# Altium project nRF2788_Wireless MIC TX_V_1_0.PrjPCB
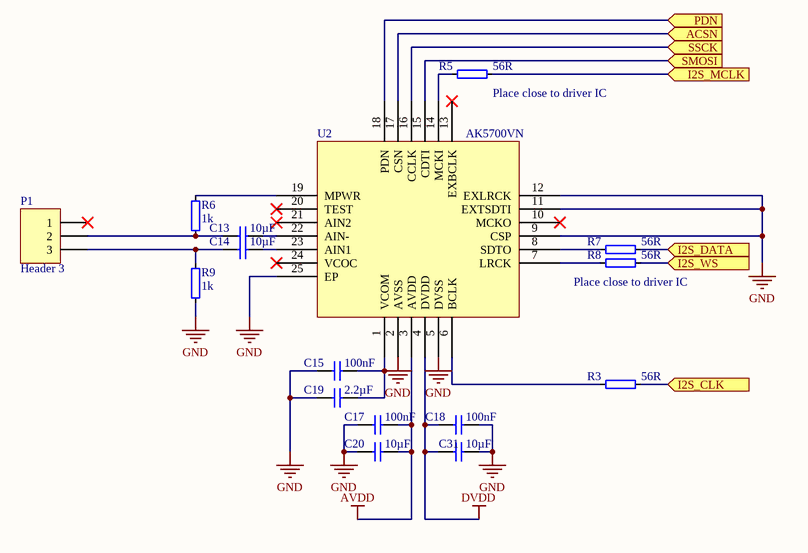
[diagram p0: ADC.SchDoc]
3 sheets, 64 parts. Net scope: flat (ports and power ports of the same name join across sheets).
Board file: nRF2788_Wireless Mic TX_rev 1_0.PcbDoc
Sheets:
  ADC.SchDoc
  MCU.SchDoc
  nRF2460.SchDoc

## Sheet ADC.SchDoc: Dual Wireless Mic TX
size A4; DrawnBy: ANOL; Revision: 1.0; SheetNumber: 2; SheetTotal: 3

### Parts
C13  10µF  [0805]
C14  10µF  [0805]
C15  100nF  [0402s]
C17  100nF  [0402s]
C18  100nF  [0402s]
C19  2.2µF  [0603s]
C20  10µF  [0603s]
C31  10µF  [0603s]
P1  Header 3  [Headphone]
R3  56R  [0402s]
R5  56R  [0402s]
R6  1k  [0402s]
R7  56R  [0402s]
R8  56R  [0402s]
R9  1k  [0402s]
U2  AK5700VN  [QFN50P400X400X80-24N]

### Ports
ACSN (in), I2S_CLK (in), I2S_DATA (in), I2S_MCLK (in), I2S_WS (in), PDN (in), SMOSI (in), SSCK (in)

### Nets
AVDD: C17.2 C20.2 U2.3(AVDD)
DVDD: C18.1 C31.1 U2.4(DVDD)
GND: C15.1 C17.1 C18.2 C19.1 C20.1 C31.2 R9.1 U2.2(AVSS) U2.5(DVSS) U2.9(CSP) U2.11(EXTSDTI) U2.12(EXLRCK) U2.25(EP)
NetC13_1: C13.1 P1.2 R6.1
NetC13_2: C13.2 U2.22(AIN-)
NetC14_1: C14.1 P1.3 R9.2
NetC14_2: C14.2 U2.23(AIN1)
NetC15_2: C15.2 C19.2 U2.1(VCOM)
NetP2_5: U2.18(PDN) ; port PDN
NetR3_1: R3.1 U2.6(BCLK)
NetR3_2: R3.2 ; port I2S_CLK
NetR5_1: R5.1 U2.14(MCKI)
NetR5_2: R5.2 ; port I2S_MCLK
NetR6_2: R6.2 U2.19(MPWR)
NetR7_1: R7.1 U2.8(SDTO)
NetR7_2: R7.2 ; port I2S_DATA
NetR8_1: R8.1 U2.7(LRCK)
NetR8_2: R8.2 ; port I2S_WS
NetU1_3: U2.16(CCLK) ; port SSCK
NetU1_6: U2.15(CDTI) ; port SMOSI
NetU2_17: U2.17(CSN) ; port ACSN

Not connected (* = marked no-connect by the designer): P1 1*; U2 10(MCKO)* 13(EXBCLK)* 20(TEST)* 21(AIN2)* 24(VCOC)*

### Notes on the sheet
- (near R5) Place close to driver IC
- (near R8) Place close to driver IC

### Library data of the parts
C13 C14 = C0805-10µ: Chip Cap 0805; Note: Chip Cap 10%; Artikkelnr Noca: 20039243; Part Number: C0805-10µ; Manufacturer: *; Manufacturer Part Number: *; Datasheet: *; LatestRevisionDate: 2010-06-03; Pin Count: 2; Publisher: Nordic Semiconductor; Published: 2010-06-03; Value: 10µF; Supplier: *; Supplier part number: *; 2nd source Supplier: *; 2nd source part number: *
C15 C17 C18 = C0402-100n: Chip Cap 0402; Note: Chip Cap 10%; Artikkelnr Noca: 20039200; Part Number: C0402-100n; Manufacturer: *; Manufacturer Part Number: *; Datasheet: *; LatestRevisionDate: 2009-11-23; Pin Count: 2; Publisher: Nordic Semiconductor; Published: 2009-05-08; Value: 100nF; Supplier: *; Supplier part number: *; 2nd source Supplier: *; 2nd source part number: *
C19 = C0603-2µ2: Chip Cap 0603; Note: Chip Cap 1%; Artikkelnr Noca: N.A.; Part Number: C0603-2µ2; Manufacturer: *; Manufacturer Part Number: *; Datasheet: *; LatestRevisionDate: 2009-05-08; Pin Count: 2; Publisher: Nordic Semiconductor; Published: 2009-05-08; Value: 2.2µF; Supplier: *; Supplier part number: *; 2nd source Supplier: *; 2nd source part number: *
C20 C31 = C0603-10µ: Chip Cap 0603; Note: Chip Cap 10%; Artikkelnr Noca: 20039252; Part Number: C0603-10µ; Manufacturer: *; Manufacturer Part Number: *; Datasheet: *; LatestRevisionDate: 2011-01-17; Pin Count: 2; Publisher: Nordic Semiconductor; Published: 2011-01-17; Value: 10µF; Supplier: *; Supplier part number: *; 2nd source Supplier: *; 2nd source part number: *
P1 = Header 3: Header, 3-Pin; LatestRevisionDate: 17-Jul-2002; LatestRevisionNote: Re-released for DXP Platform.; Publisher: Altium Limited
R3 R5 R7 R8 = R0402-56R: Chip Res 0402; Note: Chip Res 1%; Artikkelnr Noca: 27049043; Part Number: R0402-56R; Manufacturer: *; Manufacturer Part Number: *; Datasheet: *; Footprint: 0402; LatestRevisionDate: 2009-11-23; Pin Count: 2; Publisher: Nordic Semiconductor; Published: 2009-05-08; Value: 56R; Supplier: *; Supplier part number: *; 2nd source Supplier: *; 2nd source part number: *
R6 R9 = R0402-1k0: Chip Res 0402; Note: Chip Res 1%; Artikkelnr Noca: 27049073; Part Number: R0402-1k0; Manufacturer: *; Manufacturer Part Number: *; Datasheet: *; Footprint: 0402; LatestRevisionDate: 2009-11-23; Pin Count: 2; Publisher: Nordic Semiconductor; Published: 2009-05-08; Value: 1k; Supplier: *; Supplier part number: *; 2nd source Supplier: *; 2nd source part number: *

## Sheet MCU.SchDoc: Dual Wireless Mic TX
size A4; Date: 2011-06-27; DrawnBy: ANOL; Revision: 1.0; SheetNumber: 3; SheetTotal: 3
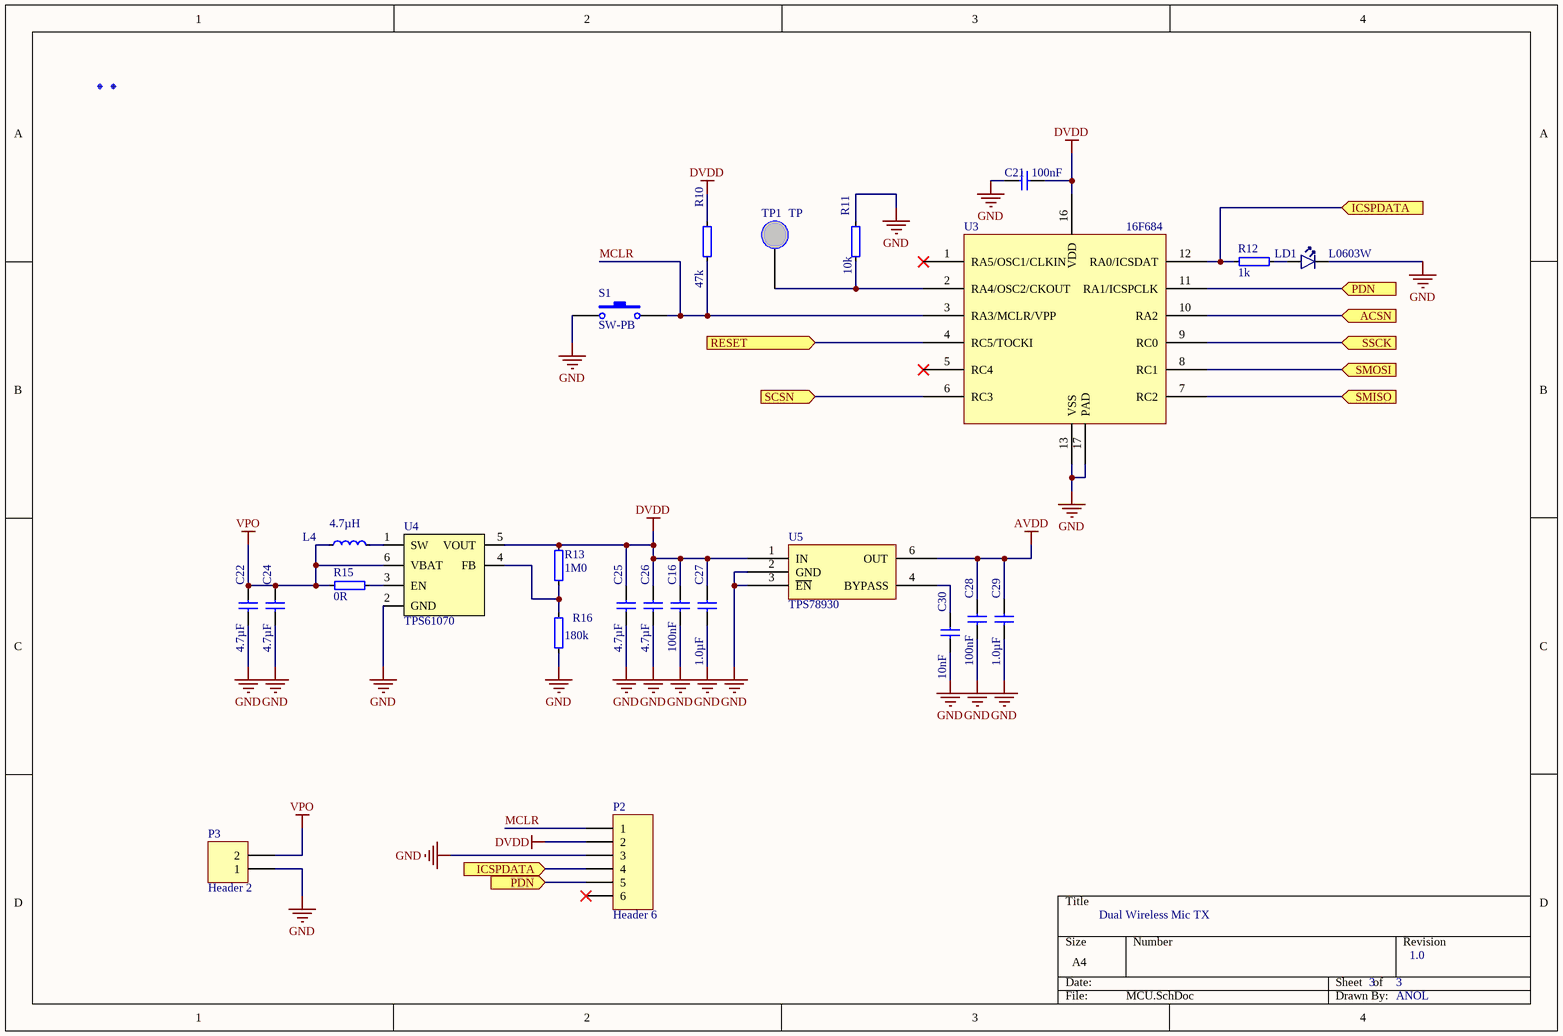
[diagram p1: MCU.SchDoc]

### Parts
C16  100nF  [0402s]
C21  100nF  [0402s]
C22  4.7µF  [0603s]
C24  4.7µF  [0603s]
C25  4.7µF  [0603s]
C26  4.7µF  [0603s]
C27  1.0µF  [0603s]
C28  100nF  [0402s]
C29  1.0µF  [0603s]
C30  10nF  [0402s]
Fid1  Fiducial mark  [Fiducial]  (value not drawn)
Fid2  Fiducial mark  [Fiducial]  (value not drawn)
L4  4.7µH  [WE-TPC_TYPE_S]
LD1  L0603W  [LED_0603]
P2  Header 6  [HDR1X6]
P3  Header 2  [HDR1X2]
R10  47k  [0402s]
R11  10k  [0402s]
R12  1k  [0402s]
R13  1M0  [0402s]
R15  0R  [0402s]
R16  180k  [0402s]
S1  SW-PB  [E-Switch]
TP1  TP  [TP]
U3  16F684  [QFN65P400X400X100-16N]
U4  TPS61070  [SOT95P280X110-6N]
U5  TPS78930  [SOT95P280X145-6N]

### Ports
ACSN (in), ICSPDATA (in), PDN (in), RESET (in), SCSN (in), SMISO (in), SMOSI (in), SSCK (in)

### Nets
AVDD: C28.2 C29.2 U5.6(OUT)
DVDD: C16.2 C21.2 C25.2 C26.2 C27.2 P2.2 R10.2 R13.2 U3.16(VDD) U4.5(VOUT) U5.1(IN)
GND: C16.1 C21.1 C22.1 C24.1 C25.1 C26.1 C27.1 C28.1 C29.1 C30.1 LD1.1(C) P2.3 P3.1 R11.2 R16.1 S1.1 U3.13(VSS) U3.17(PAD) U4.2(GND) U5.2(GND) U5.3(~{EN})
VPO: C22.2 C24.2 L4.1 P3.2 R15.1 U4.6(VBAT)
MCLR: P2.1 R10.1 S1.2 U3.3(RA3/MCLR/VPP)
NetC30_2: C30.2 U5.4(BYPASS)
NetL4_2: L4.2 U4.1(SW)
NetLD1_2: LD1.2(A) R12.2
NetP2_4: P2.4 R12.1 U3.12(RA0/ICSDAT) ; port ICSPDATA
NetP2_5: P2.5 U3.11(RA1/ICSPCLK) ; port PDN
NetR2_1: U3.4(RC5/TOCKI) ; port RESET
NetR11_1: R11.1 TP1.1 U3.2(RA4/OSC2/CKOUT)
NetR13_1: R13.1 R16.2 U4.4(FB)
NetR15_2: R15.2 U4.3(EN)
NetU1_2: U3.7(RC2) ; port SMISO
NetU1_3: U3.9(RC0) ; port SSCK
NetU1_4: U3.6(RC3) ; port SCSN
NetU1_6: U3.8(RC1) ; port SMOSI
NetU2_17: U3.10(RA2) ; port ACSN

Not connected (* = marked no-connect by the designer): P2 6*; U3 1(RA5/OSC1/CLKIN)* 5(RC4)* 14(NC) 15(NC)

### Library data of the parts
C16 C21 C28 = C0402-100n: as C15 on sheet ADC; Part Number: C0402-100n; Manufacturer: *; Manufacturer Part Number: *; Datasheet: *; LatestRevisionDate: 2009-11-23; Pin Count: 2; Publisher: Nordic Semiconductor; Published: 2009-05-08; Value: 100nF; Supplier: *; Supplier part number: *; 2nd source Supplier: *; 2nd source part number: *
C22 C24-C26 = C0603-4µ7: Chip Cap 0603; Note: Chip Cap 10%; Artikkelnr Noca: 20069060; Part Number: C0603-4µ7; Manufacturer: *; Manufacturer Part Number: *; Datasheet: *; LatestRevisionDate: 2009-11-23; Pin Count: 2; Publisher: Nordic Semiconductor; Published: 2009-05-08; Value: 4.7µF; Supplier: *; Supplier part number: *; 2nd source Supplier: *; 2nd source part number: *
C27 C29 = C0603-1µ0: Chip Cap 0603; Note: Chip Cap 10%; Artikkelnr Noca: 20039205; Part Number: C0603-1µ0; Manufacturer: *; Manufacturer Part Number: *; Datasheet: *; LatestRevisionDate: 2009-11-23; Pin Count: 2; Publisher: Nordic Semiconductor; Published: 2009-05-08; Value: 1.0µF; Supplier: *; Supplier part number: *; 2nd source Supplier: *; 2nd source part number: *
C30 = C0402-10n: Chip Cap 0402; Note: Chip Cap 10%; Artikkelnr Noca: 20039166; Part Number: C0402-10n; Manufacturer: *; Manufacturer Part Number: *; Datasheet: *; LatestRevisionDate: 2009-11-23; Pin Count: 2; Publisher: Nordic Semiconductor; Published: 2009-05-08; Value: 10nF; Supplier: *; Supplier part number: *; 2nd source Supplier: *; 2nd source part number: *
Fid1 Fid2 = Fid-Mark: Artikkelnr Noca: N.A.; Part Number: Fid-Mark; Manufacturer: *; Manufacturer Part Number: *; Datasheet: *; LatestRevisionDate: 12.12.2009; Pin Count: 1; Publisher: Nordic Semiconductor; Published: 12.12.2009; Value: *; Note: *; Supplier: *; Supplier part number: *; 2nd source Supplier: *; 2nd source part number: *
L4 = WE-TPC Type S - 4µ7: Inductor Power 4.7uH 1.2A SMD; Manufacturer: Wurth Elektronik; Manufacturer Part Number: 744031004; 2nd source part number: 732-1008-1-ND; Part Number: WE-TPC Type S - 4µ7; Datasheet: http://www.we-online.de/katalog/media/pdf/744031004.pdf; LatestRevisionDate: 2010-02-01; Pin Count: 2; Publisher: Nordic Semiconductor; Published: 2010-02-01; Value: 4.7µH; Note: *; Supplier: Farnell; Supplier part number: 163-5834; 2nd source Supplier: Digi-Key; Artikkelnr Noca: *
LD1 = 19-213/W1D: LED 0603, 19-213/W1D; Manufacturer: Everlight; Note: 45 mcd; Artikkelnr Noca: N.A.; Part Number: 19-213/W1D; Manufacturer Part Number: *; Datasheet: *; Footprint: 0603; LatestRevisionDate: 2009-05-18; Pin Count: 2; Publisher: Nordic Semiconductor; Published: 2009-05-18; Value: L0603W; Supplier: *; Supplier part number: *; 2nd source Supplier: *; 2nd source part number: *
P2 = Header 6: Header, 6-Pin; LatestRevisionDate: 17-Jul-2002; LatestRevisionNote: Re-released for DXP Platform.; Publisher: Altium Limited
P3 = Header 2: Header, 2-Pin; LatestRevisionDate: 17-Jul-2002; LatestRevisionNote: Re-released for DXP Platform.; Publisher: Altium Limited
R10 = R0402-47k: Chip Res 0402; Note: Chip Res 1%; Artikkelnr Noca: 27049113; Part Number: R0402-47k; Manufacturer: *; Manufacturer Part Number: *; Datasheet: *; Footprint: 0402; LatestRevisionDate: 2009-11-23; Pin Count: 2; Publisher: Nordic Semiconductor; Published: 2009-05-08; Value: 47k; Supplier: *; Supplier part number: *; 2nd source Supplier: *; 2nd source part number: *
R11 = R0402-10k: Chip Res 0402; Note: Chip Res 1%; Artikkelnr Noca: 27049097; Part Number: R0402-10k; Manufacturer: *; Manufacturer Part Number: *; Datasheet: *; Footprint: 0402; LatestRevisionDate: 2009-11-23; Pin Count: 2; Publisher: Nordic Semiconductor; Published: 2009-05-08; Value: 10k; Supplier: *; Supplier part number: *; 2nd source Supplier: *; 2nd source part number: *
R12 = R0402-1k0: as R6 on sheet ADC; Part Number: R0402-1k0; Manufacturer: *; Manufacturer Part Number: *; Datasheet: *; Footprint: 0402; LatestRevisionDate: 2009-11-23; Pin Count: 2; Publisher: Nordic Semiconductor; Published: 2009-05-08; Value: 1k; Supplier: *; Supplier part number: *; 2nd source Supplier: *; 2nd source part number: *
R13 = R0402-1M0: Chip Res 0402; Note: Chip Res 1%; Artikkelnr Noca: 27049145; Part Number: R0402-1M0; Manufacturer: *; Manufacturer Part Number: *; Datasheet: *; Footprint: 0402; LatestRevisionDate: 2009-11-23; Pin Count: 2; Publisher: Nordic Semiconductor; Published: 2009-05-08; Value: 1M0; Supplier: *; Supplier part number: *; 2nd source Supplier: *; 2nd source part number: *
R15 = R0402-0R: Chip Res 0402; Note: Chip Res 1%; Artikkelnr Noca: 27049000; Part Number: R0402-0R; Manufacturer: *; Manufacturer Part Number: *; Datasheet: *; Footprint: 0402; LatestRevisionDate: 2009-11-23; Pin Count: 2; Publisher: Nordic Semiconductor; Published: 2009-05-08; Value: 0R; Supplier: *; Supplier part number: *; 2nd source Supplier: *; 2nd source part number: *
R16 = R0402-180k: Chip Res 0402; Note: Chip Res 1%; Artikkelnr Noca: 27049127; Part Number: R0402-180k; Manufacturer: *; Manufacturer Part Number: *; Datasheet: *; Footprint: 0402; LatestRevisionDate: 2009-11-23; Pin Count: 2; Publisher: Nordic Semiconductor; Published: 2009-05-08; Value: 180k; Supplier: *; Supplier part number: *; 2nd source Supplier: *; 2nd source part number: *
S1 = SW-PB: Switch; Published: 24-Mar-1999; LatestRevisionDate: 17-Jul-2002; LatestRevisionNote: Re-released for DXP Platform.; PackageReference: SPST-2; Publisher: Altium Limited; PackageDescription: Switch; 2 Leads
U4 = TPS61070: IC BOOST CONV 600MA SW TSOT23-6; Manufacturer: Texas Instruments; Manufacturer Part Number: TPS61070DDCR; 2nd source part number: 296-17151-1-ND; Note: Adjustable, 600-mA Switch, 90% Efficient PFM/PWM Boost Converter in ThinSOT-23; Artikkelnr Noca: N.A.; Part Number: TPS61070; Datasheet: http://focus.ti.com/lit/ds/symlink/tps61070.pdf; Footprint: SOT-23-6; LatestRevisionDate: 2010-02-02; Pin Count: 6; Publisher: Nordic Semiconductor; Published: 2010-02-02; Value: TPS61070; Supplier: Farnell; Supplier part number: 1461062; 2nd source Supplier: Digi-Key

## Sheet nRF2460.SchDoc: Dual Wireless Mic TX
size A4; DrawnBy: ANOL; Revision: 1.0; SheetTotal: 3; : Dual Wireless Mic TX
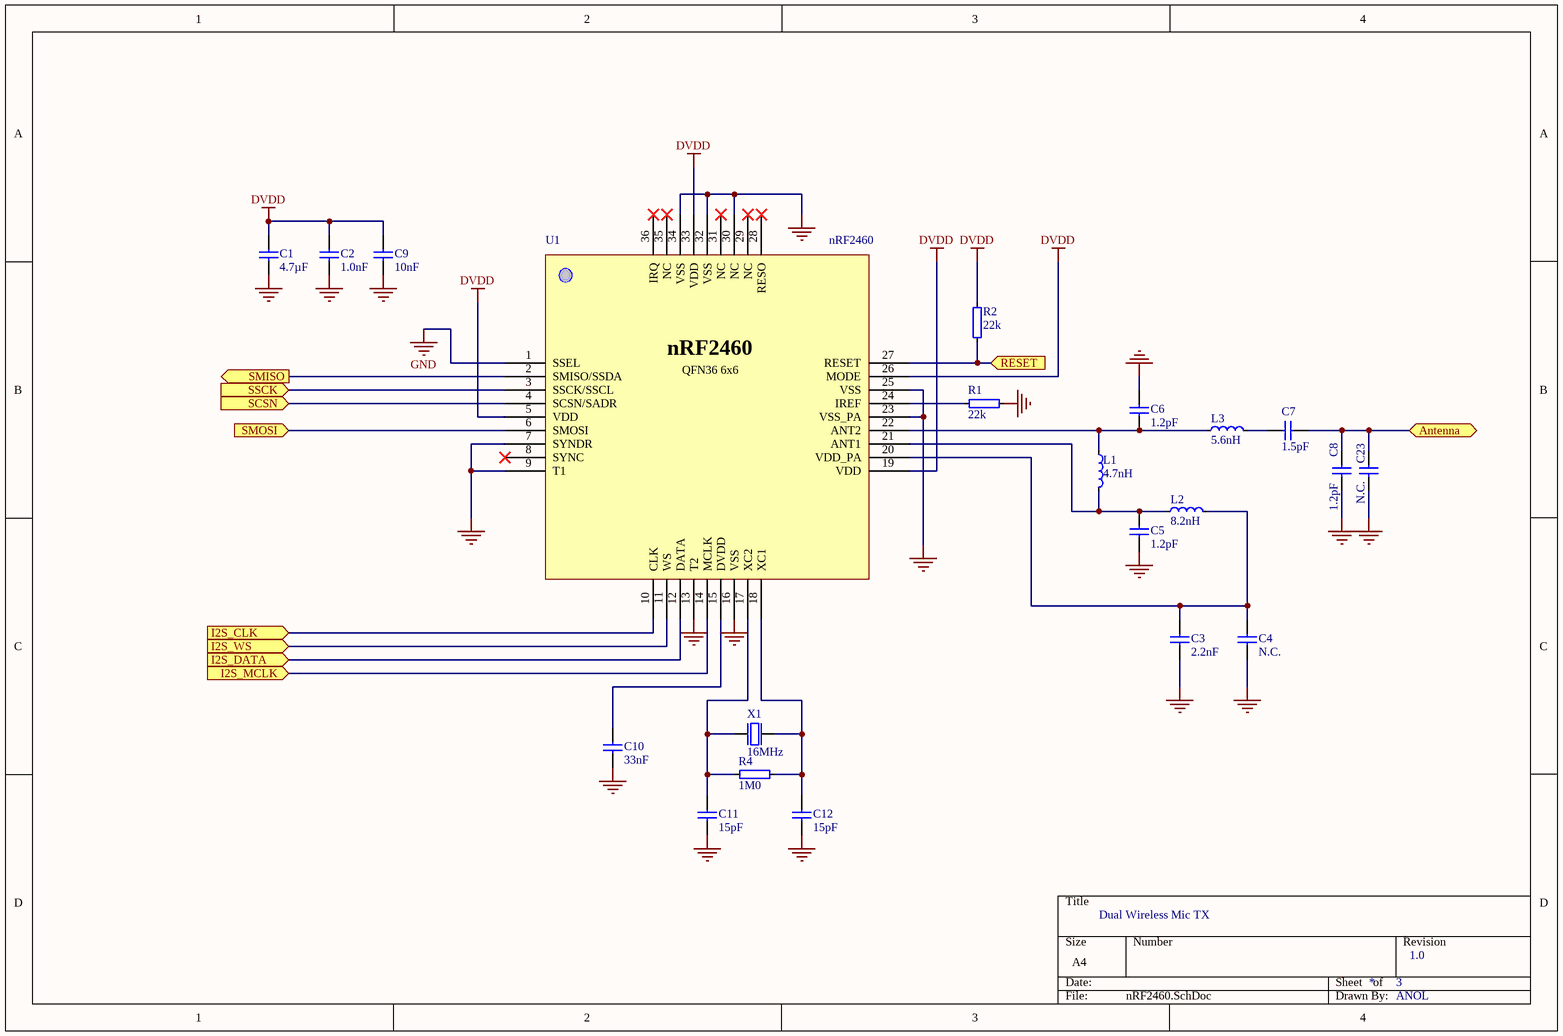
[diagram p2: nRF2460.SchDoc]

### Parts
C1  4.7µF  [0805]
C2  1.0nF  [0402s]
C3  2.2nF  [0402s]
C4  N.C.  [0402s]  (no BOM)
C5  1.2pF  [0402s]
C6  1.2pF  [0402s]
C7  1.5pF  [0402s]
C8  1.2pF  [0402s]
C9  10nF  [0402s]
C10  33nF  [0402s]
C11  15pF  [0402s]
C12  15pF  [0402s]
C23  N.C.  [0402s]  (no BOM)
L1  4.7nH  [0402s]
L2  8.2nH  [0402s]
L3  5.6nH  [0402s]
R1  22k  [0402s]
R2  22k  [0402s]
R4  1M0  [0402s]
U1  nRF2460  [Nordic_QFN36]
X1  16MHz  [BT-XTAL_3225]

### Ports
Antenna (bidir), I2S_CLK (in), I2S_DATA (in), I2S_MCLK (in), I2S_WS (in), RESET (in), SCSN (in), SMISO (out), SMOSI (in), SSCK (in)

### Nets
DVDD: C1.1 C2.1 C9.1 R2.2 U1.5(VDD) U1.19(VDD) U1.26(MODE) U1.33(VDD)
GND: C1.2 C2.2 C3.1 C4.1 C5.1 C6.2 C8.1 C9.2 C10.1 C11.1 C12.1 C23.1 R1.1 U1.1(SSEL) U1.7(SYNDR) U1.9(T1) U1.13(T2) U1.16(VSS) U1.23(VSS_PA) U1.25(VSS) U1.30(NC) U1.32(VSS) U1.34(VSS) X1.2(GND) X1.4(GND)
NetC3_2: C3.2 C4.2 L2.2 U1.20(VDD_PA)
NetC5_2: C5.2 L1.2 L2.1 U1.21(ANT1)
NetC6_1: C6.1 L1.1 L3.1 U1.22(ANT2)
NetC7_1: C7.1 C8.2 C23.2 ; port Antenna
NetC7_2: C7.2 L3.2
NetC10_2: C10.2 U1.15(DVDD)
NetC11_2: C11.2 R4.2 U1.17(XC2) X1.1(inp)
NetC12_2: C12.2 R4.1 U1.18(XC1) X1.3(out)
NetR1_2: R1.2 U1.24(IREF)
NetR2_1: R2.1 U1.27(RESET) ; port RESET
NetR3_2: U1.10(CLK) ; port I2S_CLK
NetR5_2: U1.14(MCLK) ; port I2S_MCLK
NetR7_2: U1.12(DATA) ; port I2S_DATA
NetR8_2: U1.11(WS) ; port I2S_WS
NetU1_2: U1.2(SMISO/SSDA) ; port SMISO
NetU1_3: U1.3(SSCK/SSCL) ; port SSCK
NetU1_4: U1.4(SCSN/SADR) ; port SCSN
NetU1_6: U1.6(SMOSI) ; port SMOSI

Not connected (* = marked no-connect by the designer): U1 8(SYNC)* 28(RESO)* 29(NC)* 31(NC)* 35(NC)* 36(IRQ)*

### Notes on the sheet
- (in symbol nRF2460) QFN36 6x6

### Library data of the parts
C1 = C0805-4µ7: Chip Cap 0805; Note: Chip Cap 10%; Artikkelnr Noca: 20039266; Published: 2009-08-21; LatestRevisionDate: 2009-11-23; Publisher: Nordic Semiconductor; Value: 4.7µF; Part Number: C0805-4µ7; Manufacturer: *; Manufacturer Part Number: *; Datasheet: *; Pin Count: 2; Supplier: *; Supplier part number: *; 2nd source Supplier: *; 2nd source part number: *
C2 = C0402-1n0: Chip Cap 0402; Note: Chip Cap 10%; Artikkelnr Noca: 20039223; Published: 2009-05-08; LatestRevisionDate: 2009-11-23; Publisher: Nordic Semiconductor; Value: 1.0nF; Part Number: C0402-1n0; Manufacturer: *; Manufacturer Part Number: *; Datasheet: *; Pin Count: 2; Supplier: *; Supplier part number: *; 2nd source Supplier: *; 2nd source part number: *
C3 = C0402-2n2: Chip Cap 0402; Note: Chip Cap 10%; Artikkelnr Noca: 20039221; Part Number: C0402-2n2; Manufacturer: *; Manufacturer Part Number: *; Datasheet: *; LatestRevisionDate: 2009-11-23; Pin Count: 2; Publisher: Nordic Semiconductor; Published: 2009-05-08; Value: 2.2nF; Supplier: *; Supplier part number: *; 2nd source Supplier: *; 2nd source part number: *
C4 C23 = C0402-N.C.: Chip Cap 0402; Artikkelnr Noca: N.A.; Part Number: C0402-N.C.; Manufacturer: *; Manufacturer Part Number: *; Datasheet: *; LatestRevisionDate: 2009-05-08; Pin Count: 2; Publisher: Nordic Semiconductor; Published: 2009-05-08; Value: N.C.; Note: Chip Cap; Supplier: *; Supplier part number: *; 2nd source Supplier: *; 2nd source part number: *
C5 C6 C8 = C0402-1.2p: Chip Cap 0402; Note: Chip Cap 1%; Artikkelnr Noca: N.A.; Part Number: C0402-1.2p; Manufacturer: *; Manufacturer Part Number: *; Datasheet: *; LatestRevisionDate: 2009-05-08; Pin Count: 2; Publisher: Nordic Semiconductor; Published: 2009-05-08; Value: 1.2pF; Supplier: *; Supplier part number: *; 2nd source Supplier: *; 2nd source part number: *
C7 = C0402-1.5p: Chip Cap 0402; Note: Chip Cap 1%; Artikkelnr Noca: 20029139; Part Number: C0402-1.5p; Manufacturer: *; Manufacturer Part Number: *; Datasheet: *; LatestRevisionDate: 2009-11-23; Pin Count: 2; Publisher: Nordic Semiconductor; Published: 2009-05-08; Value: 1.5pF; Supplier: *; Supplier part number: *; 2nd source Supplier: *; 2nd source part number: *
C9 = C0402-10n: as C30 on sheet MCU; Published: 2009-05-08; LatestRevisionDate: 2009-11-23; Publisher: Nordic Semiconductor; Value: 10nF; Part Number: C0402-10n; Manufacturer: *; Manufacturer Part Number: *; Datasheet: *; Pin Count: 2; Supplier: *; Supplier part number: *; 2nd source Supplier: *; 2nd source part number: *
C10 = C0402-33n: Chip Cap 0402; Note: Chip Cap 10%; Artikkelnr Noca: 20039222; Published: 2009-05-08; Publisher: Nordic Semiconductor; Value: 33nF; Part Number: C0402-33n; Manufacturer: *; Manufacturer Part Number: *; Datasheet: *; LatestRevisionDate: 2009-11-23; Pin Count: 2; Supplier: *; Supplier part number: *; 2nd source Supplier: *; 2nd source part number: *
C11 C12 = C0402-15p: Chip Cap 0402; Note: Chip Cap 5%; Artikkelnr Noca: 20029141; Published: 2009-05-08; Publisher: Nordic Semiconductor; Value: 15pF; Part Number: C0402-15p; Manufacturer: *; Manufacturer Part Number: *; Datasheet: *; LatestRevisionDate: 2009-11-23; Pin Count: 2; Supplier: *; Supplier part number: *; 2nd source Supplier: *; 2nd source part number: *
L1 = L0402-4n7: Chip Ind 0402; Manufacturer: Murata; Manufacturer Part Number: LQP15MN4N7B02D; Note: LQP15MN4N7B02D 4.7nH 160mA 0402; Artikkelnr Noca: 33029164; Part Number: L0402-4n7; Datasheet: http://search.murata.co.jp/Ceramy/image/img/PDF/ENG/L0075S0084LQP15M.pdf; Footprint: 0402; LatestRevisionDate: 2009-11-23; Pin Count: 2; Publisher: Nordic Semiconductor; Published: 2009-05-08; Value: 4.7nH; Supplier: Digi-Key; Supplier part number: 490-1132-1-ND; 2nd source Supplier: *; 2nd source part number: *
L2 = L0402-8n2: Chip Ind 0402; Manufacturer: Murata; Manufacturer Part Number: LQP15MN8N2B02D; Note: LQP15MN8N2B02D 8.2nH 110mA 0402; Artikkelnr Noca: 33029139; Part Number: L0402-8n2; Datasheet: http://search.murata.co.jp/Ceramy/image/img/PDF/ENG/L0075S0084LQP15M.pdf; Footprint: 0402; LatestRevisionDate: 2009-11-23; Pin Count: 2; Publisher: Nordic Semiconductor; Published: 2009-05-08; Value: 8.2nH; Supplier: Digi-Key; Supplier part number: 490-1135-1-ND; 2nd source Supplier: *; 2nd source part number: *
L3 = L0402-5n6: Chip Ind 0402; Manufacturer: Murata; Manufacturer Part Number: LQP15MN5N6B02D; Note: LQP15MN5N6B02D 5.6nH 140mA 0402; Artikkelnr Noca: 33029161; Part Number: L0402-5n6; Datasheet: http://search.murata.co.jp/Ceramy/image/img/PDF/ENG/L0075S0084LQP15M.pdf; Footprint: 0402; LatestRevisionDate: 2009-11-23; Pin Count: 2; Publisher: Nordic Semiconductor; Published: 2009-05-08; Value: 5.6nH; Supplier: Digi-Key; Supplier part number: 490-1133-1-ND; 2nd source Supplier: *; 2nd source part number: *
R1 R2 = R0402-22k: Chip Res 0402; Note: Chip Res 1%; Artikkelnr Noca: 27049105; Published: 2009-05-08; Publisher: Nordic Semiconductor; Value: 22k; Part Number: R0402-22k; Manufacturer: *; Manufacturer Part Number: *; Datasheet: *; Footprint: 0402; LatestRevisionDate: 2009-11-23; Pin Count: 2; Supplier: *; Supplier part number: *; 2nd source Supplier: *; 2nd source part number: *
R4 = R0402-1M0: as R13 on sheet MCU; Published: 2009-05-08; Publisher: Nordic Semiconductor; Value: 1M0; LatestRevisionDate: 2009-11-23; Part Number: R0402-1M0; Manufacturer: *; Manufacturer Part Number: *; Datasheet: *; Footprint: 0402; Pin Count: 2; Supplier: *; Supplier part number: *; 2nd source Supplier: *; 2nd source part number: *
U1 = nRF2460: 2.4GHz Single Chip Wireless Audio Streamer; Manufacturer: Nordic Semiconductor; Note: nRF2460 QFN36; Artikkelnr Noca: N.A.; Part Number: nRF2460; Manufacturer Part Number: nRF2460; Datasheet: *; Footprint: QFN-36; LatestRevisionDate: 2011-03-01; Pin Count: 36; Publisher: Nordic Semiconductor; Published: 2011-03-01; Value: nRF2460; Supplier: Nordic; Supplier part number: *; 2nd source Supplier: *; 2nd source part number: *
X1 = XTAL SMD 16MHz (3225): XTAL SMD 16MHz, 9pF, Mercury; Note: XTAL SMD 16MHz 3225; Artikkelnr Noca: 22019087; Part Number: XTAL SMD 16MHz (3225); Manufacturer: *; Manufacturer Part Number: *; Datasheet: http://ndap3-net.ebz.epson.co.jp/w/www/PDFS/epdoc_qd.nsf/85a4e2c523a1f89349257068002f9e30/31e98956c8f991cd4925707c003b38b1/$FILE/FA-238_238V_TSX-3225_E08X.pdf; LatestRevisionDate: 2010-02-24; Pin Count: 4; Publisher: Nordic Semiconductor; Published: 2009-05-30; Value: 16MHz; Supplier: *; Supplier part number: *; 2nd source Supplier: *; 2nd source part number: *

## Nets that join several sheets
AVDD: ADC (C17.2 C20.2 U2.3), MCU (C28.2 C29.2 U5.6)
DVDD: ADC (C18.1 C31.1 U2.4), MCU (11 pins), nRF2460 (8 pins)
GND: ADC (13 pins), MCU (21 pins), nRF2460 (25 pins)
NetP2_5: ADC (U2.18), MCU (P2.5 U3.11)
NetR2_1: MCU (U3.4), nRF2460 (R2.1 U1.27)
NetR3_2: ADC (R3.2), nRF2460 (U1.10)
NetR5_2: ADC (R5.2), nRF2460 (U1.14)
NetR7_2: ADC (R7.2), nRF2460 (U1.12)
NetR8_2: ADC (R8.2), nRF2460 (U1.11)
NetU1_2: MCU (U3.7), nRF2460 (U1.2)
NetU1_3: ADC (U2.16), MCU (U3.9), nRF2460 (U1.3)
NetU1_4: MCU (U3.6), nRF2460 (U1.4)
NetU1_6: ADC (U2.15), MCU (U3.8), nRF2460 (U1.6)
NetU2_17: ADC (U2.17), MCU (U3.10)